# Altium schematic sheet MasterSheet.SchDoc
size A3; Organization: Rotronic AG; Address1: Grindelstrasse 6; Address2: 8303 Bassersdorf; Address3: Switzerland; DocumentNumber: 1; SheetNumber: 1; SheetTotal: 10; Web_Address: www.rotronic.ch; E_Mail_Address: *@rotronic.ch; Fon: +41 (0)44 838 11 11; Fax: +41 (0)44 836 44 24
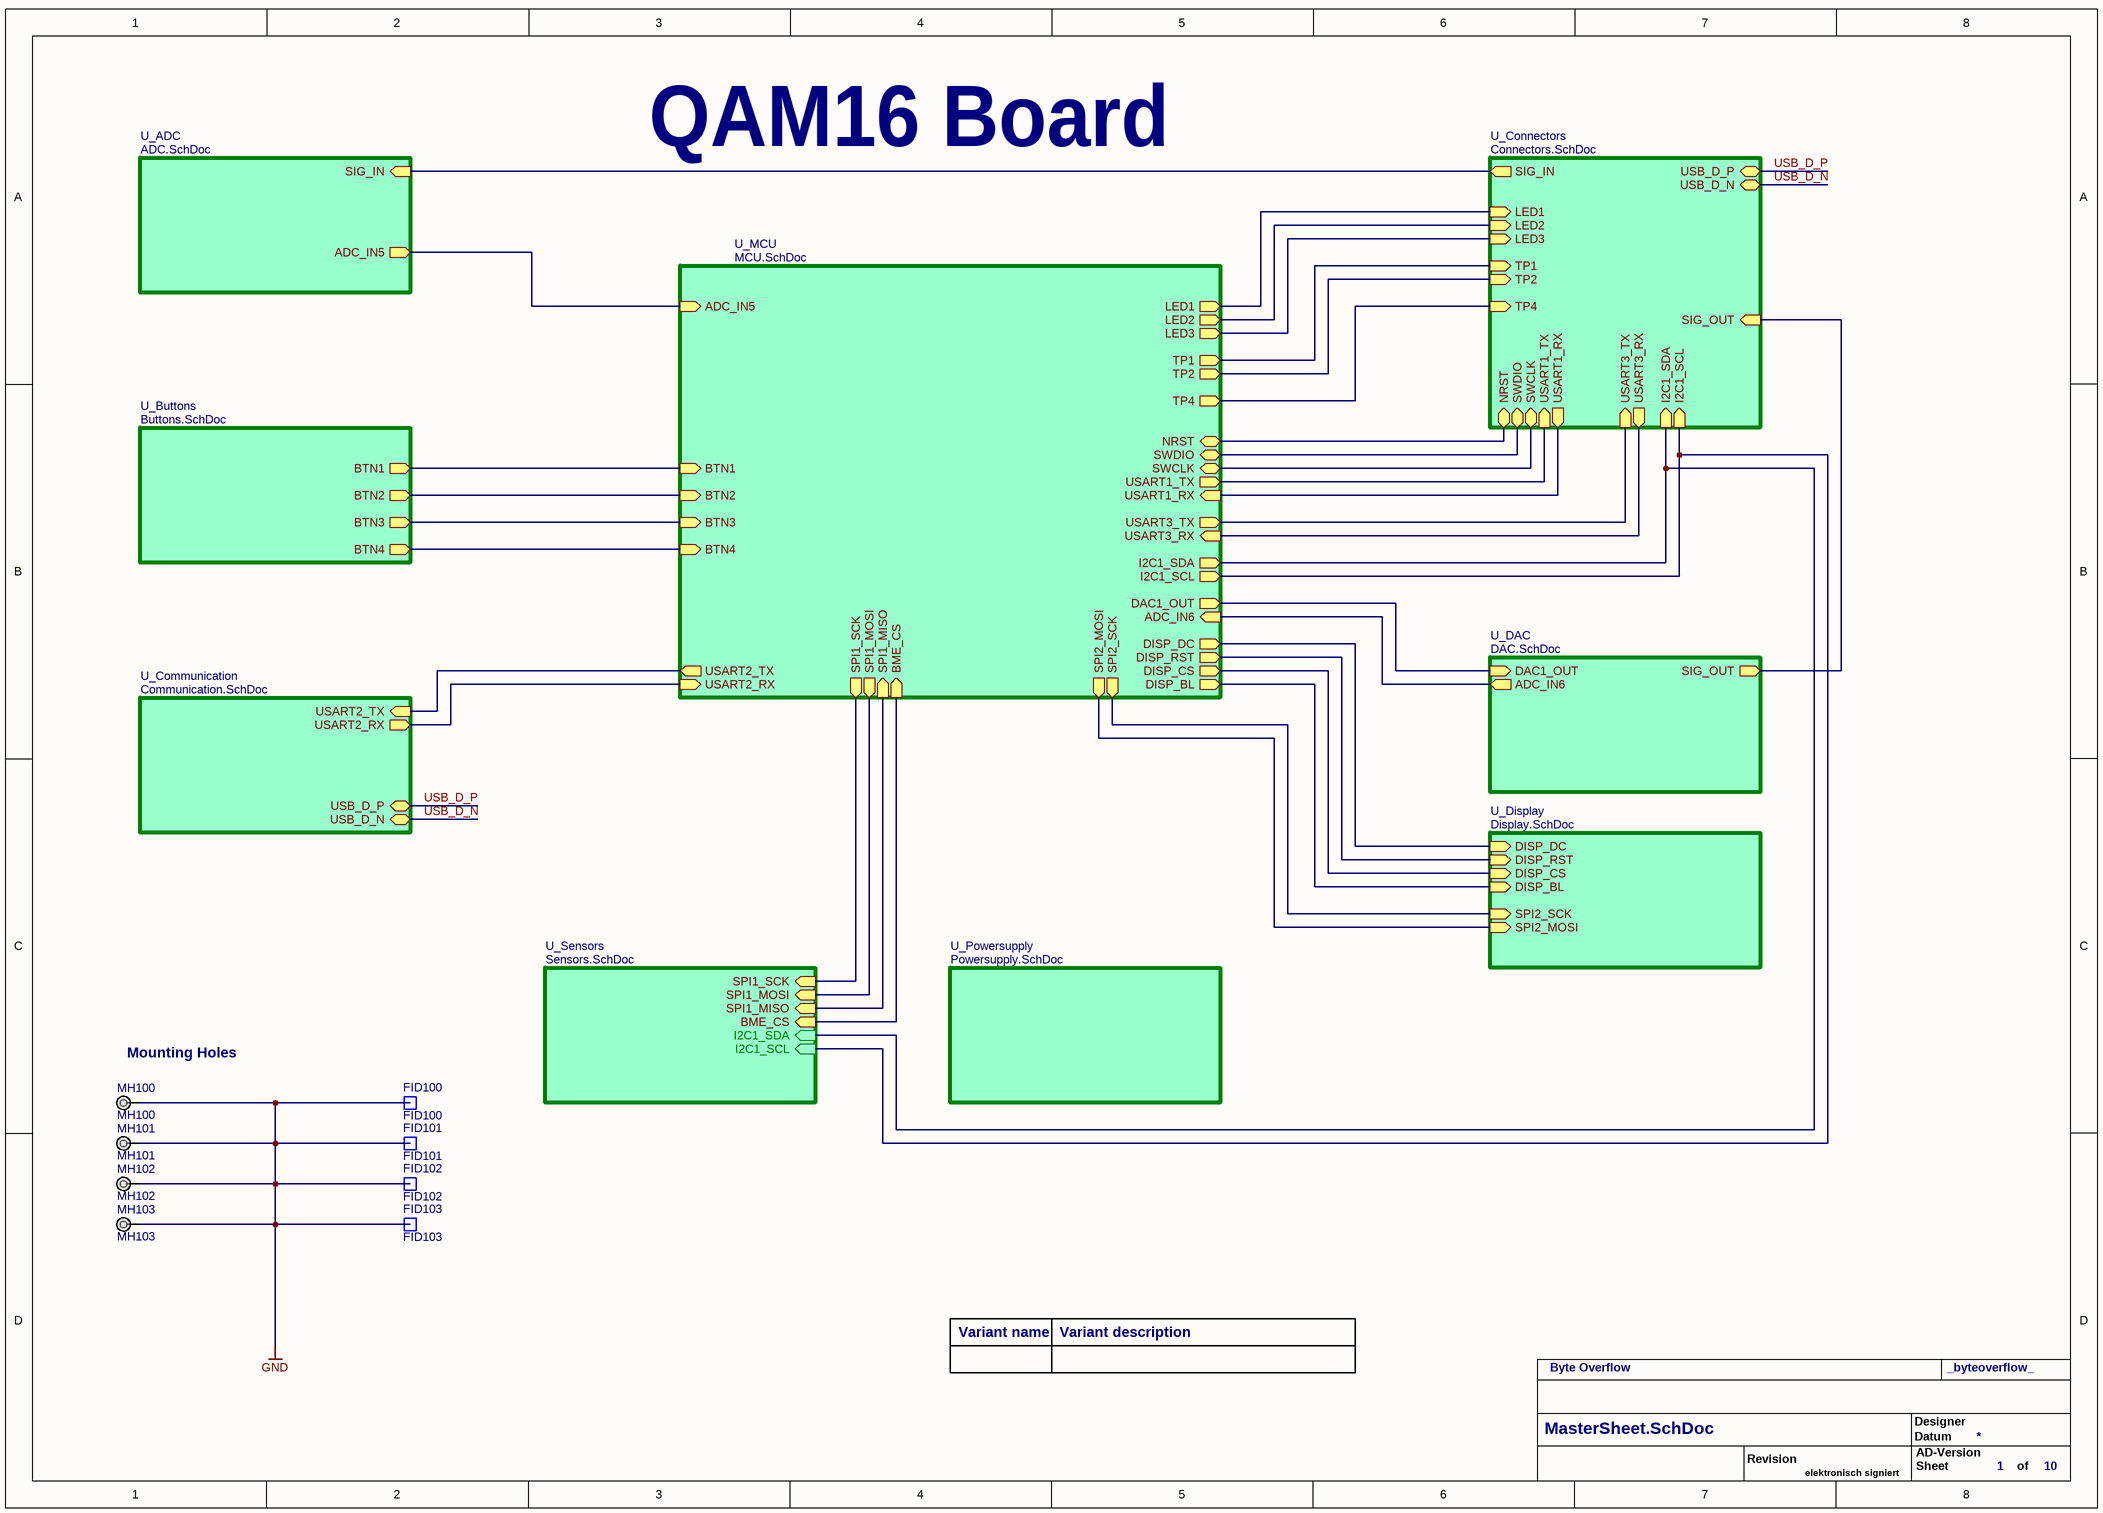
[diagram p0: MasterSheet.SchDoc]

## Parts
FID100  FID100  [FIDUCIAL_2]
FID101  FID101  [FIDUCIAL_2]
FID102  FID102  [FIDUCIAL_2]
FID103  FID103  [FIDUCIAL_2]
MH100  MH100  [MH_M3_RND_2]  (no BOM)
MH101  MH101  [MH_M3_RND_2]  (no BOM)
MH102  MH102  [MH_M3_RND_2]  (no BOM)
MH103  MH103  [MH_M3_RND_2]  (no BOM)

## Sub-sheets
U_ADC = ADC.SchDoc: ADC_IN5 (out), SIG_IN (in)
U_Buttons = Buttons.SchDoc: BTN1 (out), BTN2 (out), BTN3 (out), BTN4 (out)
U_Communication = Communication.SchDoc: USB_D_N (bidir), USB_D_P (bidir), USART2_RX (out), USART2_TX (in)
U_Connectors = Connectors.SchDoc: NRST (bidir), USB_D_N (bidir), USB_D_P (bidir), USART1_RX (out), USART1_TX (in), SWCLK (bidir), SWDIO (bidir), LED1 (in), LED2 (in), LED3 (in), USART3_RX (out), USART3_TX (in), I2C1_SDA (in), I2C1_SCL (in), SIG_IN (out), SIG_OUT (in), TP4 (in), TP2 (in), TP1 (in)
U_DAC = DAC.SchDoc: DAC1_OUT (in), SIG_OUT (out), ADC_IN6 (out)
U_Display = Display.SchDoc: DISP_DC (in), DISP_RST (in), DISP_CS (in), SPI2_SCK (in), SPI2_MOSI (in), DISP_BL (in)
U_MCU = MCU.SchDoc: SWCLK (bidir), SWDIO (bidir), NRST (bidir), SPI1_SCK (out), SPI1_MOSI (out), SPI1_MISO (in), USART1_RX (in), BTN2 (in), BTN1 (in), USART3_RX (in), USART3_TX (out), TP2 (out), TP1 (out), BME_CS (in), USART2_RX (in), ADC_IN6 (in), ADC_IN5 (in), BTN4 (in), BTN3 (in), USART2_TX (out), DAC1_OUT (out), DISP_DC (out), DISP_RST (out), DISP_CS (out), DISP_BL (out), SPI2_SCK (out), SPI2_MOSI (out), I2C1_SDA (out), I2C1_SCL (out), USART1_TX (out), TP4 (out), LED1 (out), LED2 (out), LED3 (out)
U_Powersupply = Powersupply.SchDoc: no entries
U_Sensors = Sensors.SchDoc: SPI1_SCK (in), SPI1_MOSI (in), SPI1_MISO (in), BME_CS (in), I2C1_SDA (in), I2C1_SCL (in)

## Nets
GND: FID100.1 FID101.1 FID102.1 FID103.1 MH100.1 MH101.1 MH102.1 MH103.1
USB_D_N: sheet U_Communication/USB_D_N, sheet U_Connectors/USB_D_N
USB_D_P: sheet U_Communication/USB_D_P, sheet U_Connectors/USB_D_P
(unnamed): sheet U_ADC/ADC_IN5, sheet U_MCU/ADC_IN5
(unnamed): sheet U_ADC/SIG_IN, sheet U_Connectors/SIG_IN
(unnamed): sheet U_Buttons/BTN1, sheet U_MCU/BTN1
(unnamed): sheet U_Buttons/BTN2, sheet U_MCU/BTN2
(unnamed): sheet U_Buttons/BTN3, sheet U_MCU/BTN3
(unnamed): sheet U_Buttons/BTN4, sheet U_MCU/BTN4
(unnamed): sheet U_Communication/USART2_RX, sheet U_MCU/USART2_RX
(unnamed): sheet U_Communication/USART2_TX, sheet U_MCU/USART2_TX
(unnamed): sheet U_Connectors/NRST, sheet U_MCU/NRST
(unnamed): sheet U_Connectors/USART1_RX, sheet U_MCU/USART1_RX
(unnamed): sheet U_Connectors/USART1_TX, sheet U_MCU/USART1_TX
(unnamed): sheet U_Connectors/SWCLK, sheet U_MCU/SWCLK
(unnamed): sheet U_Connectors/SWDIO, sheet U_MCU/SWDIO
(unnamed): sheet U_Connectors/LED1, sheet U_MCU/LED1
(unnamed): sheet U_Connectors/LED2, sheet U_MCU/LED2
(unnamed): sheet U_Connectors/LED3, sheet U_MCU/LED3
(unnamed): sheet U_Connectors/USART3_RX, sheet U_MCU/USART3_RX
(unnamed): sheet U_Connectors/USART3_TX, sheet U_MCU/USART3_TX
(unnamed): sheet U_Connectors/I2C1_SDA, sheet U_Sensors/I2C1_SDA, sheet U_MCU/I2C1_SDA
(unnamed): sheet U_Connectors/I2C1_SCL, sheet U_Sensors/I2C1_SCL, sheet U_MCU/I2C1_SCL
(unnamed): sheet U_Connectors/SIG_OUT, sheet U_DAC/SIG_OUT
(unnamed): sheet U_Connectors/TP4, sheet U_MCU/TP4
(unnamed): sheet U_Connectors/TP2, sheet U_MCU/TP2
(unnamed): sheet U_Connectors/TP1, sheet U_MCU/TP1
(unnamed): sheet U_DAC/DAC1_OUT, sheet U_MCU/DAC1_OUT
(unnamed): sheet U_DAC/ADC_IN6, sheet U_MCU/ADC_IN6
(unnamed): sheet U_Display/DISP_DC, sheet U_MCU/DISP_DC
(unnamed): sheet U_Display/DISP_RST, sheet U_MCU/DISP_RST
(unnamed): sheet U_Display/DISP_CS, sheet U_MCU/DISP_CS
(unnamed): sheet U_Display/SPI2_SCK, sheet U_MCU/SPI2_SCK
(unnamed): sheet U_Display/SPI2_MOSI, sheet U_MCU/SPI2_MOSI
(unnamed): sheet U_Display/DISP_BL, sheet U_MCU/DISP_BL
(unnamed): sheet U_Sensors/SPI1_SCK, sheet U_MCU/SPI1_SCK
(unnamed): sheet U_Sensors/SPI1_MOSI, sheet U_MCU/SPI1_MOSI
(unnamed): sheet U_Sensors/SPI1_MISO, sheet U_MCU/SPI1_MISO
(unnamed): sheet U_Sensors/BME_CS, sheet U_MCU/BME_CS

## Notes on the sheet
- QAM16 Board
- (near MH100) Mounting Holes
- Variant name
- Variant description
- Byte Overflow
- _byteoverflow_
- Revision
- Designer
- Datum
- AD-Version
- elektronisch signiert
- Sheet
- of

## Library data of the parts
FID100-FID103 = C0039: FIDUCIAL; Part-Number: 00.0000.0000; Designator: FIDUCIAL-2; ID: C0039; Operating Range: -50°C to +130°C; Specification: 19.09.2011 MLP; Value: FIDUCIAL-2; Component Type: Standard; Status: Active; Availability Date: -; RoHS compliant: Yes; Flammability: UL 94 V-0; Note: FIDUCIAL-2; Price Date: 07.10.2011 MLP; Price 100: 0; Price 1000: 0; Pin Count: 1; Changed: 19.09.2011 MLP; Price: 0
MH100-MH103 = C0025: PCB hole; Part-Number: 00.0000.0000; ID: C0025; Operating Range: -50°C to +130°C; Specification: 15.01.2013 OPT; Value: MH_M3_RND_2; Designator: MH_M3_RND_2; Component Type: Standard; Status: Active; Availability Date: -; Note: MH_M3_RND_2; Price Date: 15.01.2013 OPT; Price 100: 0; Price 1000: 0; Pin Count: 1; Changed: 15.01.2013 OPT; Price: 0.000